# EasyEDA Pro project 立创 Project Zero.eprj

# Schematic Schematic1
Board Name: Board1; Create Date: 2025-04-28; Page Name: P1; Project Name: 立创 Project Zero; Schematic Name: Schematic1; Update Date: 2025-04-28; Company: 嘉立创EDA; Page Size: A4; Version: V1.0
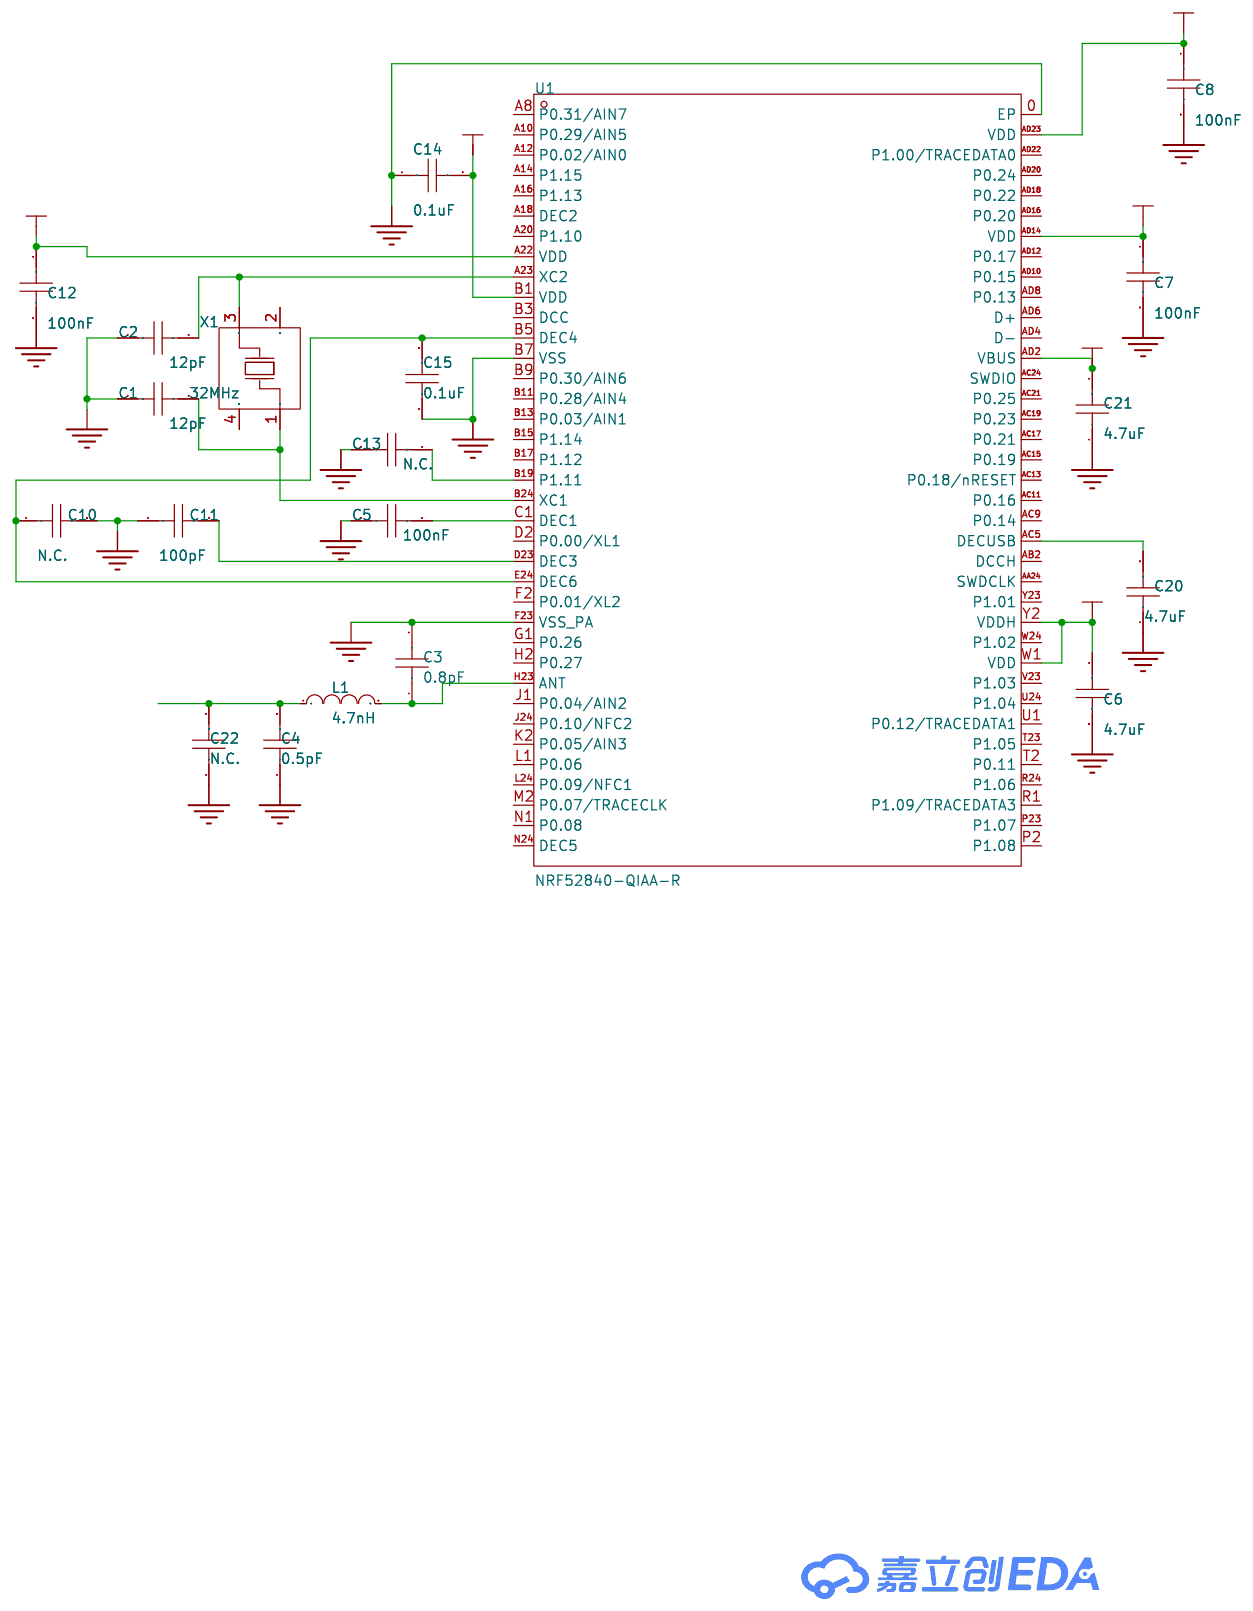
[diagram p0: schematic sheet]

## Parts
C1  12pF  [C0603]
C2  12pF  [C0603]
C3  0.8pF  [C0603]
C4  0.5pF  [C0603]
C5  100nF  [C0603]
C6  4.7uF  [C0603]
C7  100nF  [C0603]
C8  100nF  [C0603]
C10  N.C.  [C0603]
C11  100pF  [C0603]
C12  100nF  [C0603]
C13  N.C.  [C0603]
C14  0.1uF  [C0603]
C15  0.1uF  [C0603]
C20  4.7uF  [C0603]
C21  4.7uF  [C0603]
C22  N.C.  [C0603]
L1  4.7nH  [L0603]
U1  NRF52840-QIAA-R  [AQFN-73_L7.0-W7.0-P0.50-BL-EP4.8]
X1  32MHz  [CRYSTAL-SMD_4P-L3.2-W2.5-BL]

## Library data of the parts
C1-C8 C10-C15 C20-C22 = CAP_0603: Supplier Footprint: 0603
L1 = L_0603
U1 = NRF52840-QIAA-R: LCSC Part Name: 蓝牙，IEEE 802.15.4-2006，2.4GHz收发器; Supplier Part: C190794; Manufacturer: NORDIC; Supplier Footprint: AQFN-73-EP(7x7); JLCPCB Part Class: 扩展库; Datasheet: https://atta.szlcsc.com/upload/public/pdf/source/20200927/C190794_1756B5489BD6AA72AA26FA1BF8B48337.pdf; Supplier: LCSC; Frequency Range: 2.4GHz~2.4835GHz; Interface: ADC；PWM；I2S；GPIO；UART；USB；SPI; Operating Voltage: 1.7V~5.5V; Applications: ISM；蓝牙；ZigBee；IoT；LoRa; Output Power: 8dBm; Data Rate: 2Mbps; Current Of Transmitting: 4.82mA; Sensitivity: -95dBm; Receive Current: 6.26mA; Typical Application Frequency: 2.4GHz; Operating Temperature: -40℃~+85℃
X1 = X322532MOB4SI: LCSC Part Name: 32MHz ±10ppm 12pF; Supplier Part: C9009; Manufacturer: YXC(扬兴晶振); Supplier Footprint: SMD3225-4P; JLCPCB Part Class: 扩展库; Datasheet: https://atta.szlcsc.com/upload/public/pdf/source/20240329/19D5F850207469550BEB00D7DFEDBC7A.pdf; Supplier: LCSC; Crystal Type: 贴片晶振; Normal temperature Frequency Tolerance: ±10ppm; External load capacitor: 12pF; Frequency Stability(Full temperature range): ±20ppm; Operating Temperature: -40℃~+85℃

## Nets
GND: C1.1 C2.1 C3.2 C4.1 C5.1 C6.2 C7.2 C8.2 C10.2 C11.1 C12.2 C13.1 C14.1 C15.1 C20.1 C21.1 C22.1 U1.0(EP) U1.B7(VSS) U1.F23(VSS_PA)
VBUS: C21.2 U1.AD2(VBUS)
VDD: C6.1 C7.1 C8.1 C12.1 C14.2 U1.A22(VDD) U1.AD14(VDD) U1.AD23(VDD) U1.B1(VDD) U1.W1(VDD) U1.Y2(VDDH)
Net-(C1-2): C1.2 U1.B24(XC1) X1.1(OSC1)
Net-(C2-2): C2.2 U1.A23(XC2) X1.3(OSC2)
Net-(C3-1): C3.1 L1.2 U1.H23(ANT)
Net-(C4-2): C4.2 C22.2 L1.1
Net-(C5-2): C5.2 U1.C1(DEC1)
Net-(C10-1): C10.1 C15.2 U1.B5(DEC4) U1.E24(DEC6)
Net-(C11-2): C11.2 U1.D23(DEC3)
Net-(C13-2): C13.2 U1.B19(P1.11)
Net-(C20-2): C20.2 U1.AC5(DECUSB)

Not connected (* = marked no-connect by the designer): U1 A8(P0.31/AIN7) A10(P0.29/AIN5) A12(P0.02/AIN0) A14(P1.15) A16(P1.13) A18(DEC2) A20(P1.10) AA24(SWDCLK) AB2(DCCH) AC9(P0.14) AC11(P0.16) AC13(P0.18/nRESET) AC15(P0.19) AC17(P0.21) AC19(P0.23) AC21(P0.25) AC24(SWDIO) AD4(D-) AD6(D+) AD8(P0.13) AD10(P0.15) AD12(P0.17) AD16(P0.20) AD18(P0.22) AD20(P0.24) AD22(P1.00/TRACEDATA0) B3(DCC) B9(P0.30/AIN6) B11(P0.28/AIN4) B13(P0.03/AIN1) B15(P1.14) B17(P1.12) D2(P0.00/XL1) F2(P0.01/XL2) G1(P0.26) H2(P0.27) J1(P0.04/AIN2) J24(P0.10/NFC2) K2(P0.05/AIN3) L1(P0.06) L24(P0.09/NFC1) M2(P0.07/TRACECLK) N1(P0.08) N24(DEC5) P2(P1.08) P23(P1.07) R1(P1.09/TRACEDATA3) R24(P1.06) T2(P0.11) T23(P1.05) U1(P0.12/TRACEDATA1) U24(P1.04) V23(P1.03) W24(P1.02) Y23(P1.01); X1 2(GND) 4(GND)
